# EAGLE design temp-board (EAGLE 4.16)
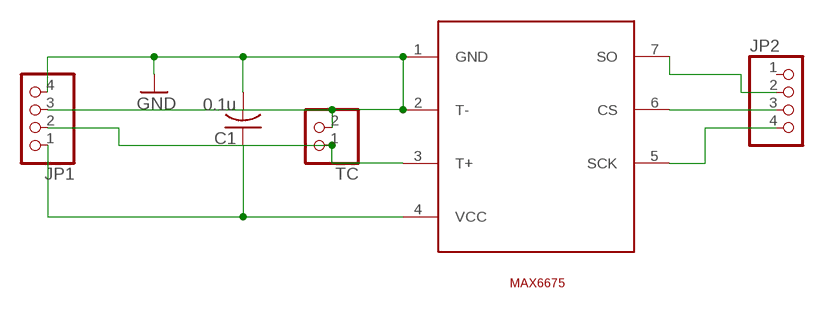
[diagram p0: schematic, sheet 1]

## Parts
C1  0.1u  C-US025-030X050  [C025-030X050]
JP1  PINHD-1X4  [1X04]
JP2  PINHD-1X4  [1X04]
TC  PINHD-1X2_2.54  [1X02]
U$1  MAX6675  [SO08]

## Nets
GND: C1.2 JP1.3 JP1.4 TC.2 U$1.1(GND) U$1.2(T-)
N$2: JP2.3 U$1.6(CS)
N$3: C1.1 JP1.1 U$1.4(VCC)
N$4: JP1.2 TC.1 U$1.3(T+)
N$5: JP2.4 U$1.5(SCK)
N$6: JP2.2 U$1.7(SO)
Unconnected: JP2.1

## Library data of the parts
C1 = rcl:C-US: CAPACITOR, American symbol
JP1 JP2 = pinhead:PINHD-1X4: PIN HEADER
TC = pinhead-1:PINHD-1X2: PIN HEADER
U$1 = maxim:MAX6675

## Board
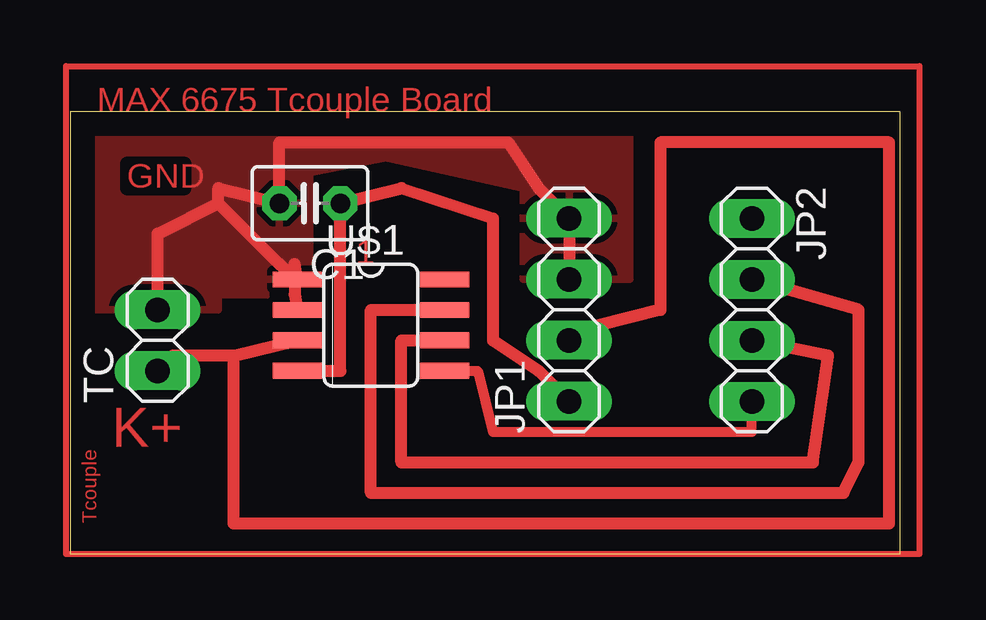
[diagram p1: board, top side]

Size 34.59 x 18.41 mm. Coordinates in mm from the lower left corner, seen from the top.
Outline: 0,0 34.59,0 34.59,18.41 0,18.41 0,0
Copper layers (1*16): Top 0.035mm / dielectric 1.5mm / Bottom 0.035mm
Design rules "dave": minimum track width 20mil, minimum drill 24mil, track to track 12mil, track to pad 12mil, pad to pad 12mil, via to via 12mil, smd to smd 8mil, copper to edge 40mil, drill to drill 12mil, minimum pad ring 12mil, minimum via ring 12mil, stop-mask expansion 4mil, vias tented up to drill 0mil, thermal gap 10mil

### Footprints (pad centres in the part's own frame; a part is rotated, then mirrored left to right if it is on the bottom)
C025-030X050 = drill 0.813 octagon: 1 -1.27,0; 2 1.27,0
1X04 = drill 1.016 long: 1 -3.81,0; 2 -1.27,0; 3 1.27,0; 4 3.81,0
1X02 = drill 1.016 long: 1 -1.27,0; 2 1.27,0
SO08 = smd 0.66 x 2.032: 1 -1.905,-3.073; 2 -0.635,-3.073; 3 0.635,-3.073; 4 1.905,-3.073; 5 1.905,3.073; 6 0.635,3.073; 7 -0.635,3.073; 8 -1.905,3.073

### Placement (x,y rotation side)
C1  10,14.6 180 top
JP1  20.79,10.15 90 top
JP2  28.41,10.15 270 top
TC  3.65,8.88 90 top
U$1  12.54,9.52 270 top

### Tracks (layer width: path | path; a pad name or v marks a point on that pad's centre or on a via)
GND
  Top 0.508: JP1.3 JP1.4 19.52,15.23 18.25,17.14 8.73,17.14 C1.2 6.18,15.23 6.18,14.6 | U$1.2 9.36,10.79 9.36,12.06 U$1.1 8.73,12.06 6.18,14.6 | 6.18,14.6 3.65,13.33 TC.2
  pour Top: 6.18,10.15 0.47,10.15 0.47,18.41 23.33,18.41 23.33,11.42 18.89,11.42 18.89,15.23 13.17,16.51 10,15.87 10,17.14 10,10.79 6.18,10.79
N$1
  Top 0.254: -0.17,-0.01 -0.17,20.32 35.4,20.32 35.4,-0.01 -0.17,-0.01
N$2
  Top 0.508: U$1.6 13.81,8.88 13.81,3.81 30.95,3.81 31.59,8.25 JP2.3
N$3
  Top 0.508: U$1.4 11.27,7.62 C1.1 13.81,15.23 17.62,13.96 17.62,8.88 19.52,7.62 JP1.1
N$4
  Top 0.508: 6.82,8.25 4.28,8.25 TC.1 | 6.82,8.25 U$1.3 | 6.82,8.25 6.82,1.27 34.12,1.27 34.12,17.14 24.6,17.14 24.6,10.15 22.06,9.52 JP1.2
N$5
  Top 0.406: U$1.5 16.98,7.62 17.62,5.08 28.41,5.08 JP2.4
N$6
  Top 0.508: U$1.7 12.54,10.15 12.54,2.54 32.22,2.54 32.86,3.81 32.86,10.15 JP2.2

### Text on the board
Top: MAX 6675 Tcouple Board | GND | 1 | K+ | Tcouple